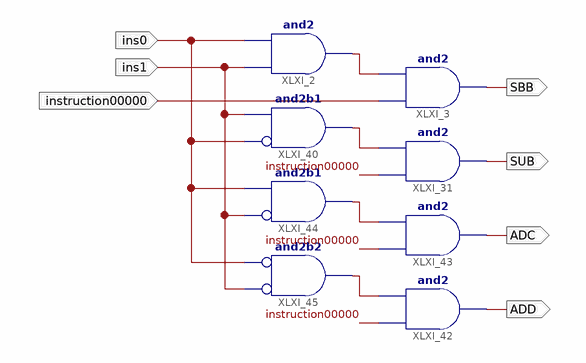
[diagram p0: schematic sheet 1]
// Xilinx ISE schematic ins00000.sch (spartan6) as structural Verilog: 8 symbols, 7 ports
module ins00000 (
  input  instruction00000,
  input  ins0,
  input  ins1,
  output SBB,
  output SUB,
  output ADD,
  output ADC
);

  wire XLXN_2, XLXN_85, XLXN_110, XLXN_115;

  and XLXI_2 (XLXN_2, ins1, ins0);
  and XLXI_3 (SBB, instruction00000, XLXN_2);
  and XLXI_31 (SUB, instruction00000, XLXN_85);
  and XLXI_40 (XLXN_85, ~ins0, ins1);  // and2b1
  and XLXI_42 (ADD, instruction00000, XLXN_110);
  and XLXI_45 (XLXN_110, ~ins1, ~ins0);  // and2b2
  and XLXI_44 (XLXN_115, ~ins1, ins0);  // and2b1
  and XLXI_43 (ADC, instruction00000, XLXN_115);
endmodule
